# EAGLE schematic PWM2Bebop (EAGLE 7.2.0)
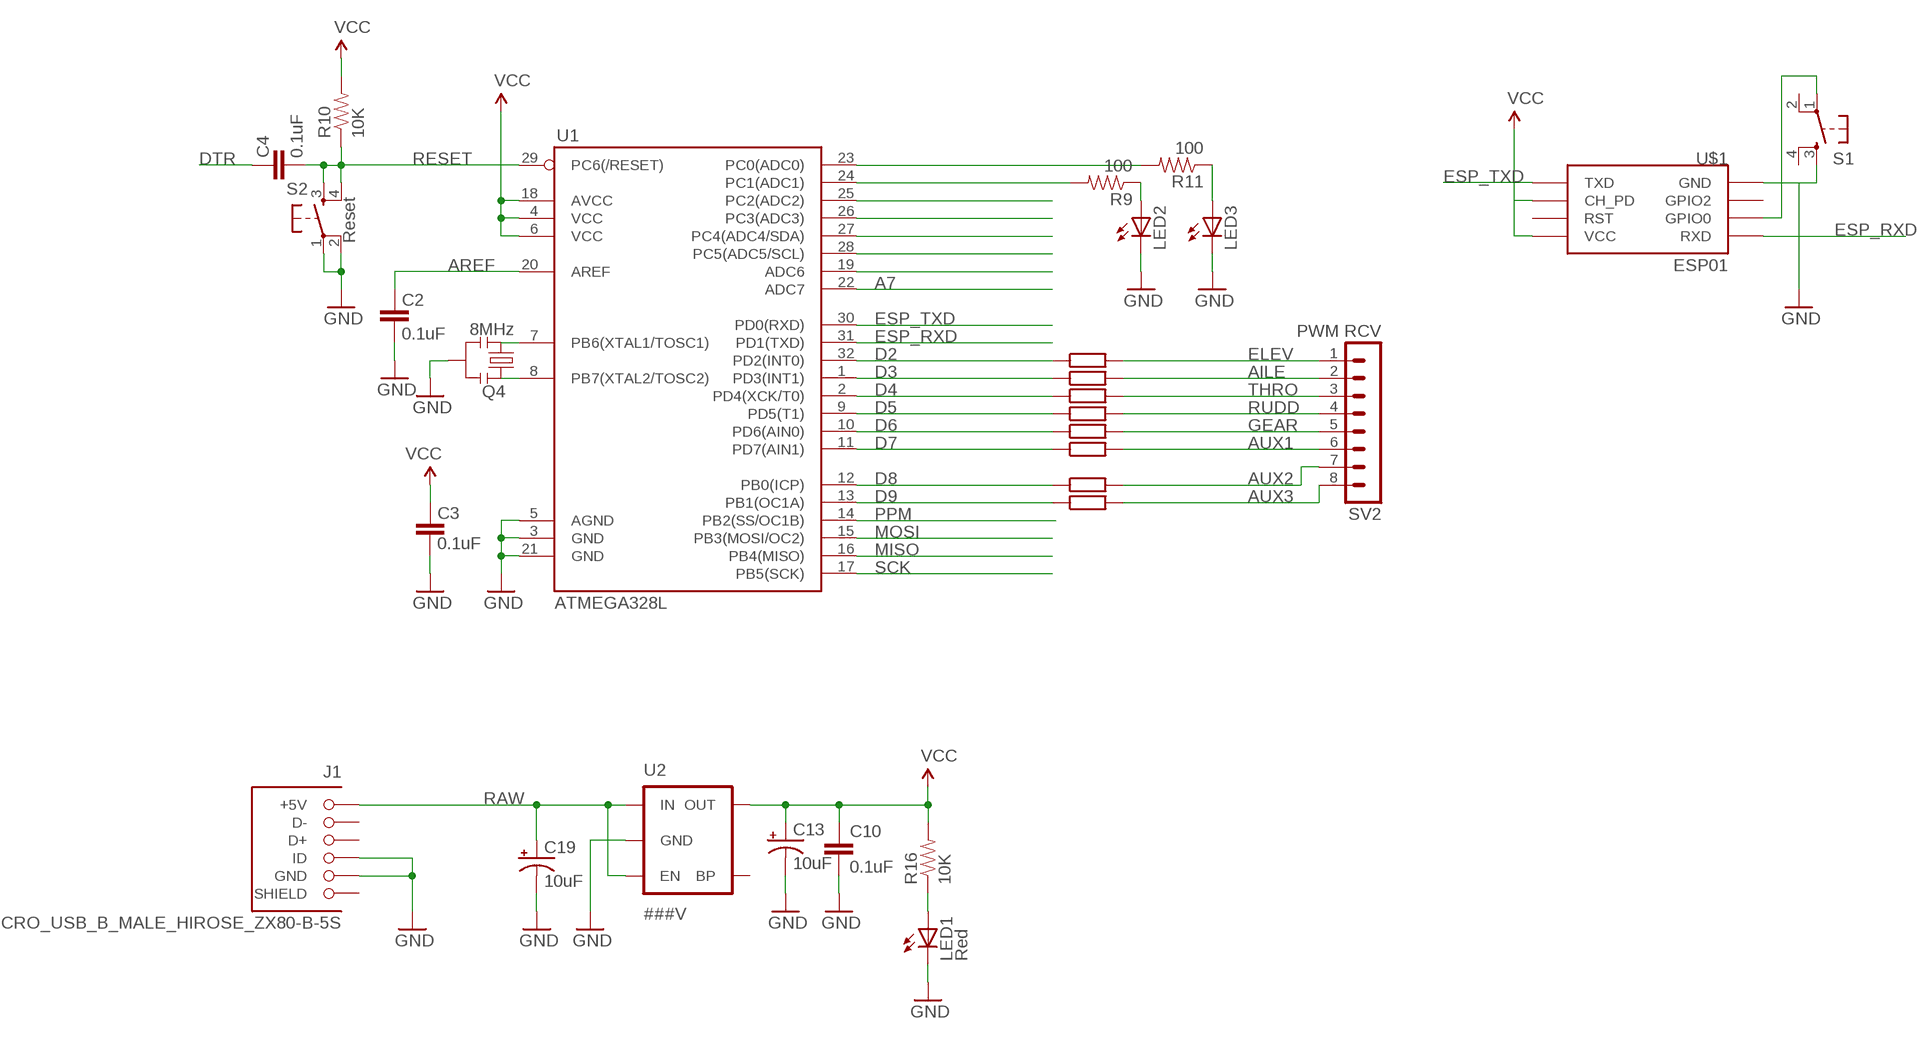
[diagram p0: schematic, sheet 1]

## Parts
C2  0.1uF  CAP0402  [C0402]
C3  0.1uF  CAP0402  [C0402]
C4  0.1uF  CAP0402  [C0402]
C10  0.1uF  CAP0402  [C0402]
C13  10uF  CAP_POL1206  [EIA3216]
C19  10uF  CAP_POL1206  [EIA3216]
J1  MICRO_USB_B_MALE_HIROSE_ZX80-B-5S  [USB_MICRO_B_MALE-HIROSE-ZX80-B-5S]
LED1  Red  LED0603  [LED-0603]
LED2  Red  LED0603  [LED-0603]
LED3  Red  LED0603  [LED-0603]
Q4  8MHz  RESONATORSMD  [RESONATOR-SMD]
R9  100  RESISTOR0402  [C0402]
R10  10K  RESISTOR0402  [C0402]
R11  100  RESISTOR0402  [C0402]
R16  10K  RESISTOR0402  [C0402]
S1  Reset  TAC_SWITCHSND  [TACTILE_SWITCH_SMD]
S2  Reset  TAC_SWITCHSND  [TACTILE_SWITCH_SMD]
SV2  PWM RCV  MA08-1  [MA08-1]
U1  ATMEGA328L  ATMEGA168  [TQFP32-08]
U2  ###V  V_REG_LDOSMD  [SOT23-5]
U$1  ESP01  [ESP01]

## Nets
3.3V: U$1.CH_PD U$1.VCC ; supply symbol labelled VCC
A7: U1.22(ADC7)
AILE: SV2.2
AREF: C2.2 U1.20(AREF)
AUX1: SV2.6
AUX2: SV2.7
AUX3: SV2.8
CSN_A7105: U1.25(PC2(ADC2))
CSN_CC25: U1.26(PC3(ADC3))
CSN_CYRF: U1.28(PC5(ADC5/SCL))
CSN_NRF: U1.27(PC4(ADC4/SDA))
D2: U1.32(PD2(INT0))
D3: U1.1(PD3(INT1))
D4: U1.2(PD4(XCK/T0))
D5: U1.9(PD5(T1))
D6: U1.10(PD6(AIN0))
D7: U1.11(PD7(AIN1))
D8: U1.12(PB0(ICP))
D9: U1.13(PB1(OC1A))
DTR: C4.2
ELEV: SV2.1
ESP_RXD: U1.31(PD1(TXD)) U$1.RX(RXD)
ESP_TXD: U1.30(PD0(RXD)) U$1.TX(TXD)
GEAR: SV2.5
GND: C2.1 C3.1 C10.2 C13.C(-) C19.C(-) J1.4(ID) J1.5(GND) LED1.C LED2.C LED3.C Q4.2 S1.3 S2.1 S2.2 U1.3(GND) U1.5(AGND) U1.21(GND) U2.2(GND) U$1.GND
MISO: U1.16(PB4(MISO))
MOSI: U1.15(PB3(MOSI/OC2))
N$1: S1.1 U$1.GPIO0
N$2: LED2.A R9.1
N$3: LED3.A R11.1
N$11: Q4.1 U1.8(PB7(XTAL2/TOSC2))
N$12: Q4.3 U1.7(PB6(XTAL1/TOSC1))
N$38: LED1.A R16.1
PE1: R11.2 U1.23(PC0(ADC0))
PE2: R9.2 U1.24(PC1(ADC1))
PPM: U1.14(PB2(SS/OC1B))
RAW [vcc]: C19.A(+) J1.1(+5V) U2.1(IN) U2.3(EN)
RESET: C4.1 R10.1 S2.3 S2.4 U1.29(PC6(/RESET))
RST_CYRF: U1.19(ADC6)
RUDD: SV2.4
SCK: U1.17(PB5(SCK))
THRO: SV2.3
VCC: C3.2 C10.1 C13.A(+) R10.2 R16.2 U1.4(VCC) U1.6(VCC) U1.18(AVCC) U2.5(OUT)
Unconnected: J1.2(D-) J1.3(D+) J1.SHIELD1(SHIELD) J1.SHIELD2(SHIELD) J1.SHIELD3(SHIELD) J1.SHIELD4(SHIELD) S1.2 S1.4 U2.4(BP) U$1.GPIO2 U$1.RST

## Library data of the parts
C2-C4 C10 = SparkFun:CAP: Capacitor Standard 0603 ceramic capacitor, and 0.1" leaded capacitor.
C13 C19 = SparkFun:CAP_POL: Capacitor Polarized These are standard SMD and PTH capacitors. Normally 10uF, 47uF, and 100uF in electrolytic and tantalum varieties. Always verify the external diameter of the through hole cap, it varies with capacity, voltage, and manufacturer. The EIA devices should be standard.
J1 = connector:MICRO_USB_B_MALE_HIROSE_ZX80-B-5S: CONN PLUG MCR USB B PCB VERT; DIGIKEY: H11612-ND
LED1-LED3 = SparkFun:LED: LEDs Standard schematic elements and footprints for 5mm, 3mm, 1206, and 0603 sized LEDs. 5mm - Spark Fun Electronics SKU : COM-00529 (and others)
Q4 = SparkFun:RESONATOR: Resonator Small SMD resonator. This is the itty bitty 10/20MHz resonators with built in caps. CSTCE10M0G55 and CSTCE20M0V53. Footprint has been reviewed closely but hasn't been tested yet.
R9-R11 R16 = SparkFun:RESISTOR: Resistor Basic schematic elements and footprints for 0603, 1206, and PTH 1/10th watt (small) resistors.
S1 S2 = SparkFun:TAC_SWITCH: Momentary Switch Button commonly used for reset or general input. Spark Fun Electronics SKU : COM-00097
SV2 = con-lstb:MA08-1: PIN HEADER; OC_FARNELL: unknown; OC_NEWARK: unknown
U1 = SparkFun:ATMEGA168
U2 = SparkFun:V_REG_LDO: Voltage Regulator LDO Standard 150mA LDO voltage regulator in SOT-23 layout. Micrel part MIC5205. BP (by-pass) pin is used to lower output noise with 470pF cap.
U$1 = esp8266modules:ESP01: ESP8266 Wifi module 01

## Net classes
1 vcc: width 0.254 mm